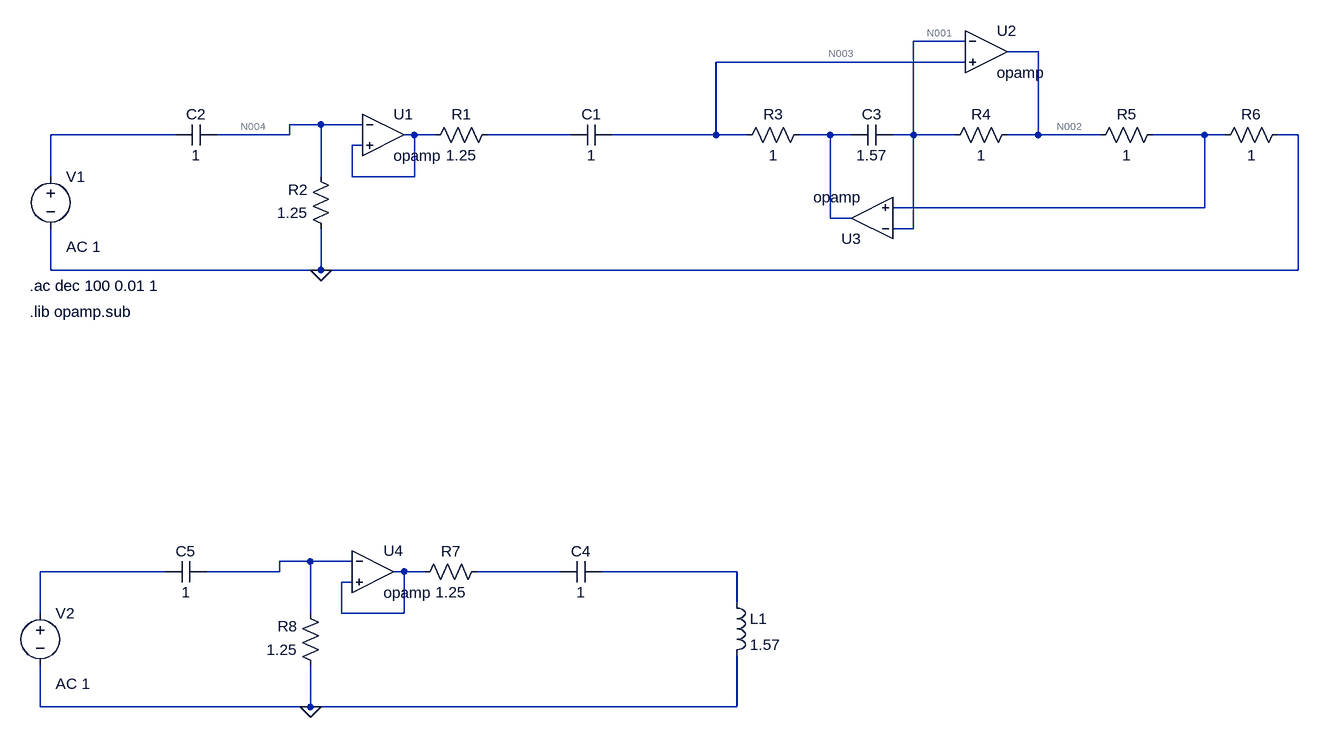
[diagram p0: schematic tp4.asc]
tp4.asc, the LTspice schematic file:
Version 4
SHEET 1 1796 1012
WIRE 1280 -32 1200 -32
WIRE 1392 -16 1344 -16
WIRE 1280 0 896 0
WIRE 288 96 240 96
WIRE 352 96 288 96
WIRE 64 112 -128 112
WIRE 240 112 240 96
WIRE 240 112 128 112
WIRE 432 112 416 112
WIRE 464 112 432 112
WIRE 672 112 544 112
WIRE 896 112 896 0
WIRE 896 112 736 112
WIRE 944 112 896 112
WIRE 1072 112 1024 112
WIRE 1104 112 1072 112
WIRE 1200 112 1200 -32
WIRE 1200 112 1168 112
WIRE 1264 112 1200 112
WIRE 1392 112 1392 -16
WIRE 1392 112 1344 112
WIRE 1488 112 1392 112
WIRE 1648 112 1568 112
WIRE 1680 112 1648 112
WIRE 1792 112 1760 112
WIRE 352 128 336 128
WIRE -128 176 -128 112
WIRE 288 176 288 96
WIRE 336 176 336 128
WIRE 432 176 432 112
WIRE 432 176 336 176
WIRE 1648 224 1648 112
WIRE 1648 224 1168 224
WIRE 1072 240 1072 112
WIRE 1104 240 1072 240
WIRE 1200 256 1200 112
WIRE 1200 256 1168 256
WIRE -128 320 -128 256
WIRE 288 320 288 256
WIRE 288 320 -128 320
WIRE 1792 320 1792 112
WIRE 1792 320 288 320
WIRE 272 768 224 768
WIRE 336 768 272 768
WIRE 48 784 -144 784
WIRE 224 784 224 768
WIRE 224 784 112 784
WIRE 416 784 400 784
WIRE 448 784 416 784
WIRE 656 784 528 784
WIRE 928 784 720 784
WIRE 336 800 320 800
WIRE 928 832 928 784
WIRE -144 848 -144 784
WIRE 272 848 272 768
WIRE 320 848 320 800
WIRE 416 848 416 784
WIRE 416 848 320 848
WIRE -144 992 -144 928
WIRE 272 992 272 928
WIRE 272 992 -144 992
WIRE 928 992 928 912
WIRE 928 992 272 992
FLAG 288 320 0
FLAG 272 992 0
SYMBOL res 560 96 R90
WINDOW 0 0 56 VBottom 2
WINDOW 3 32 56 VTop 2
SYMATTR InstName R1
SYMATTR Value 1.25
SYMBOL res 304 272 R180
WINDOW 0 36 76 Left 2
WINDOW 3 36 40 Left 2
SYMATTR InstName R2
SYMATTR Value 1.25
SYMBOL cap 736 96 R90
WINDOW 0 0 32 VBottom 2
WINDOW 3 32 32 VTop 2
SYMATTR InstName C1
SYMATTR Value 1
SYMBOL cap 128 96 R90
WINDOW 0 0 32 VBottom 2
WINDOW 3 32 32 VTop 2
SYMATTR InstName C2
SYMATTR Value 1
SYMBOL voltage -128 160 R0
WINDOW 123 24 124 Left 2
WINDOW 39 0 0 Left 2
SYMATTR Value2 AC 1
SYMATTR InstName V1
SYMATTR Value ""
SYMBOL Opamps\\opamp 384 48 R0
SYMATTR InstName U1
SYMBOL res 1040 96 R90
WINDOW 0 0 56 VBottom 2
WINDOW 3 32 56 VTop 2
SYMATTR InstName R3
SYMATTR Value 1
SYMBOL res 1360 96 R90
WINDOW 0 0 56 VBottom 2
WINDOW 3 32 56 VTop 2
SYMATTR InstName R4
SYMATTR Value 1
SYMBOL res 1584 96 R90
WINDOW 0 0 56 VBottom 2
WINDOW 3 32 56 VTop 2
SYMATTR InstName R5
SYMATTR Value 1
SYMBOL res 1776 96 R90
WINDOW 0 0 56 VBottom 2
WINDOW 3 32 56 VTop 2
SYMATTR InstName R6
SYMATTR Value 1
SYMBOL cap 1168 96 R90
WINDOW 0 0 32 VBottom 2
WINDOW 3 32 32 VTop 2
SYMATTR InstName C3
SYMATTR Value 1.57
SYMBOL Opamps\\opamp 1312 -80 R0
SYMATTR InstName U2
SYMBOL Opamps\\opamp 1136 304 R180
SYMATTR InstName U3
SYMBOL res 544 768 R90
WINDOW 0 0 56 VBottom 2
WINDOW 3 32 56 VTop 2
SYMATTR InstName R7
SYMATTR Value 1.25
SYMBOL res 288 944 R180
WINDOW 0 36 76 Left 2
WINDOW 3 36 40 Left 2
SYMATTR InstName R8
SYMATTR Value 1.25
SYMBOL cap 720 768 R90
WINDOW 0 0 32 VBottom 2
WINDOW 3 32 32 VTop 2
SYMATTR InstName C4
SYMATTR Value 1
SYMBOL cap 112 768 R90
WINDOW 0 0 32 VBottom 2
WINDOW 3 32 32 VTop 2
SYMATTR InstName C5
SYMATTR Value 1
SYMBOL Opamps\\opamp 368 720 R0
SYMATTR InstName U4
SYMBOL voltage -144 832 R0
WINDOW 123 24 124 Left 2
WINDOW 39 0 0 Left 2
SYMATTR Value2 AC 1
SYMATTR InstName V2
SYMATTR Value ""
SYMBOL ind 912 816 R0
SYMATTR InstName L1
SYMATTR Value 1.57
TEXT -160 344 Left 2 !.ac dec 100 0.01 1
TEXT -160 384 Left 2 !.lib opamp.sub

The netlist it stands for:
* tp4.asc
R1 N007 N006 1.25
R2 0 N004 1.25
C1 N003 N007 1
C2 N004 N005 1
V1 N005 0 AC 1
XU1 N004 N006 N006 opamp Aol=100K GBW=10Meg  ; pins invin noninvin out
R3 N008 N003 1
R4 N002 N001 1
R5 N009 N002 1
R6 0 N009 1
C3 N001 N008 1.57
XU2 N001 N003 N002 opamp Aol=100K GBW=10Meg  ; pins invin noninvin out
XU3 N001 N009 N008 opamp Aol=100K GBW=10Meg  ; pins invin noninvin out
R7 N013 N012 1.25
R8 0 N010 1.25
C4 N014 N013 1
C5 N010 N011 1
XU4 N010 N012 N012 opamp Aol=100K GBW=10Meg  ; pins invin noninvin out
V2 N011 0 AC 1
L1 N014 0 1.57
.ac dec 100 0.01 1
.lib opamp.sub
.backanno
.end

* Results of the author's LTspice run, read from the files saved beside the schematic
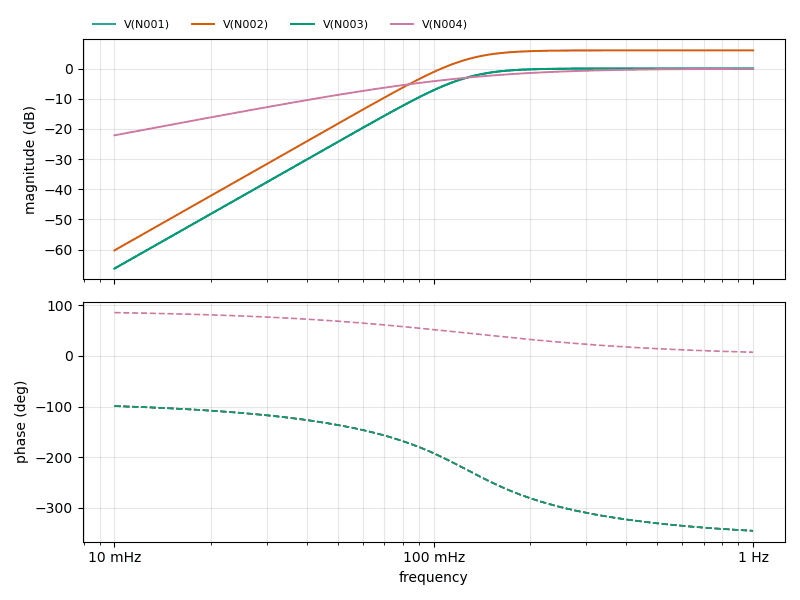
[diagram p1: AC Analysis of tp4.asc, plotted from the saved traces]
* AC Analysis, 1 run:
*   V(N001): -66.25 dB at 10 mHz, -0.00 dB at 1 Hz, peak -0.00 dB at 1 Hz, 3 dB below the peak at 126.9 mHz
*   V(N002): -60.23 dB at 10 mHz, 6.02 dB at 1 Hz, peak 6.02 dB at 1 Hz, 3 dB below the peak at 126.9 mHz
*   V(N003): -66.25 dB at 10 mHz, -0.00 dB at 1 Hz, peak -0.00 dB at 1 Hz, 3 dB below the peak at 126.9 mHz
*   V(N004): -22.12 dB at 10 mHz, -0.07 dB at 1 Hz, peak -0.07 dB at 1 Hz, 3 dB below the peak at 125.3 mHz